# EAGLE design LGA-14_3x2.5 (EAGLE 9.6.2)
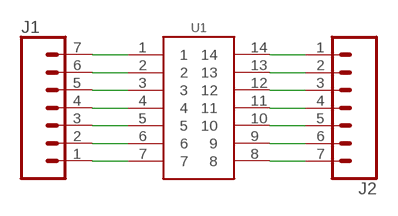
[diagram p0: schematic, sheet 1]

## Parts
J1  CONN_07  [1X07]
J2  CONN_07  [1X07]
U1  GEN_14LGA_3X2.5  [PQFN50P250X300X97-14N]

## Nets
N$1: J1.1 U1.7
N$2: J1.2 U1.6
N$3: J1.3 U1.5
N$4: J1.4 U1.4
N$5: J1.5 U1.3
N$6: J1.6 U1.2
N$7: J1.7 U1.1
N$8: J2.1 U1.14
N$9: J2.2 U1.13
N$10: J2.3 U1.12
N$11: J2.4 U1.11
N$12: J2.5 U1.10
N$13: J2.6 U1.9
N$14: J2.7 U1.8

## Library data of the parts
J1 J2 = bschulz:CONN_07: Multi connection point. Often used as Generic Header-pin footprint for 0.1 inch spaced/style header connections On any of the 0.1 inch spaced packages, you can populate with these: Break Away Headers - Straight <https://www.sparkfun.com/products/116> (PRT-00116) Break Away Male Headers - Right Angle <https://www.sparkfun.com/products/553> (PRT-00553) Female Headers <https://www.sparkfun.com/products/115> (PRT-00115) Break Away Headers - Machine Pin <https://www.sparkfun.com/products/117> (PRT-00117) Break Away Female Headers - Swiss Machine Pin <https://www.sparkfun.com/products/743> (PRT-00743) For SCREWTERMINALS and SPRING TERMINALS visit here: Screw Terimnals on SparkFun.com <https://www.sparkfun.com/search/results?term=Screw+Terminals> (5mm/3.5mm/2.54mm spacing) This device is also useful as a general connection point to wire up your design to another part of your project. Our various solder wires solder well into these plated through hole pads. Hook-Up Wire - Assortment (Stranded, 22 AWG) <https://www.sparkfun.com/products/11375> (PRT-11375) Hook-Up Wire - Assortment (Solid Core, 22 AWG) <https://www.sparkfun.com/products/11367> (PRT-11367) View the entire wire category on our website here <https://www.sparkfun.com/categories/141> Special notes: Molex polarized connector foot print use with SKU : PRT-08231 with associated crimp pins and housings. 1MM SMD Version SKU: PRT-10208 NOTES ON THE VARIANTS LOCK and LOCK_LONGPADS... This footprint was designed to help hold the alignment of a through-hole component (i.e. 6-pin header) while soldering it into place. You may notice that each hole has been shifted either up or down by 0.005 of an inch from it's more standard position (which is a perfectly straight line). This slight alteration caused the pins (the squares in the middle) to touch the edges of the holes. Because they are alternating, it causes a "brace" to hold the component in place. 0.005 has proven to be the perfect amount of "off-center" position when using our standard breakaway headers. Although looks a little odd when you look at the bare footprint, once you have a header in there, the alteration is very hard to notice. Also,if you push a header all the way into place, it is covered up entirely on the bottom side.
U1 = bschulz:GEN_14: Generic 14 Pin Package for Breakout Boards

## Board
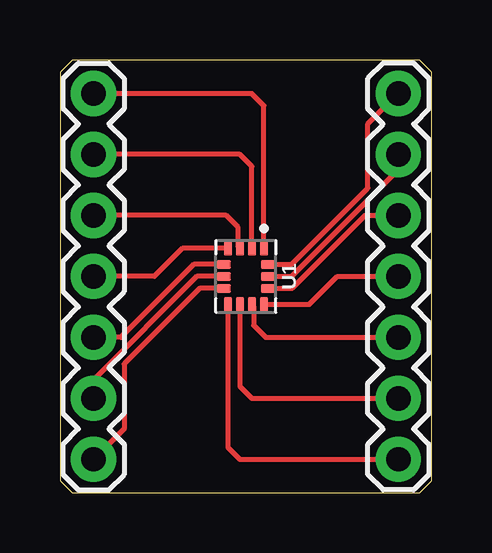
[diagram p1: board, top side]

Size 15.49 x 18.03 mm. Coordinates in mm from the lower left corner, seen from the top.
Outline: 0,17.53 0,0.5 0.5,0 14.99,0 15.49,0.5 15.49,17.53 14.99,18.03 0.5,18.03 0,17.53
Copper layers (1*16): Top 0.035559375mm / dielectric 1.6mm / Bottom 0.035559375mm
Design rules "oshpark-2layer": minimum track width 6mil, minimum drill 10mil, track to track 6mil, track to pad 6mil, pad to pad 6mil, via to via 6mil, smd to smd 6mil, copper to edge 15mil, drill to drill 6mil, minimum pad ring 5mil, minimum via ring 5mil, stop-mask expansion 2.5mil, vias tented up to drill 0mil, thermal gap 10mil

### Footprints (pad centres in the part's own frame; a part is rotated, then mirrored left to right if it is on the bottom)
1X07 = drill 1.016 pad 1.88: 1 0,0; 2 2.54,0; 3 5.08,0; 4 7.62,0; 5 10.16,0; 6 12.7,0; 7 15.24,0
PQFN50P250X300X97-14N = smd 0.59 x 0.35: 1 -1.165,0.75; 2 -1.165,0.25; 3 -1.165,-0.25; 4 -1.165,-0.75; 8 1.165,-0.75; 9 1.165,-0.25; 10 1.165,0.25; 11 1.165,0.75 | smd 0.35 x 0.59: 5 -0.5,-0.915; 6 0,-0.915; 7 0.5,-0.915; 12 0.5,0.915; 13 0,0.915; 14 -0.5,0.915

### Placement (x,y rotation side)
J1  1.4,1.4 90 top
J2  14.1,16.64 270 top
U1  7.75,9.02 270 top

### Tracks (layer width: path | path; a pad name or v marks a point on that pad's centre or on a via)
N$1
  Top 0.2: U1.7 5.82,8.52 2.67,5.37 2.67,2.67 J1.1
N$2
  Top 0.2: U1.6 5.71,9.02 1.4,4.71 J1.2
N$3
  Top 0.2: U1.5 5.58,9.52 2.54,6.48 J1.3
N$4
  Top 0.2: U1.4 5.1,10.18 3.94,9.02 J1.4
N$5
  Top 0.2: U1.3 7.42,10.26 7.42,11.06 6.92,11.56 J1.5
N$6
  Top 0.2: U1.2 8,13.6 7.5,14.1 J1.6
N$7
  Top 0.2: U1.1 8.5,16.14 8,16.64 J1.7
N$8
  Top 0.2: U1.14 9.65,9.52 12.83,12.7 12.83,15.37 J2.1
N$9
  Top 0.2: U1.13 9.65,9.02 14.1,13.46 J2.2
N$10
  Top 0.2: U1.12 9.67,8.52 12.71,11.56 J2.3
N$11
  Top 0.2: U1.11 10.39,7.85 11.56,9.02 J2.4
N$12
  Top 0.2: U1.10 8.07,7.78 8.07,6.98 8.57,6.48 J2.5
N$13
  Top 0.2: U1.9 7.5,4.44 8,3.94 J2.6
N$14
  Top 0.2: U1.8 7,1.9 7.5,1.4 J2.7

### Text on the board
tDocu: 1 | LGA-14 | 14 | 2 | 13 | 3 | 12 | 4 | 11 | 5 | 10 | 6 | 9 | B. Schulz / Break44 | 7 | 8